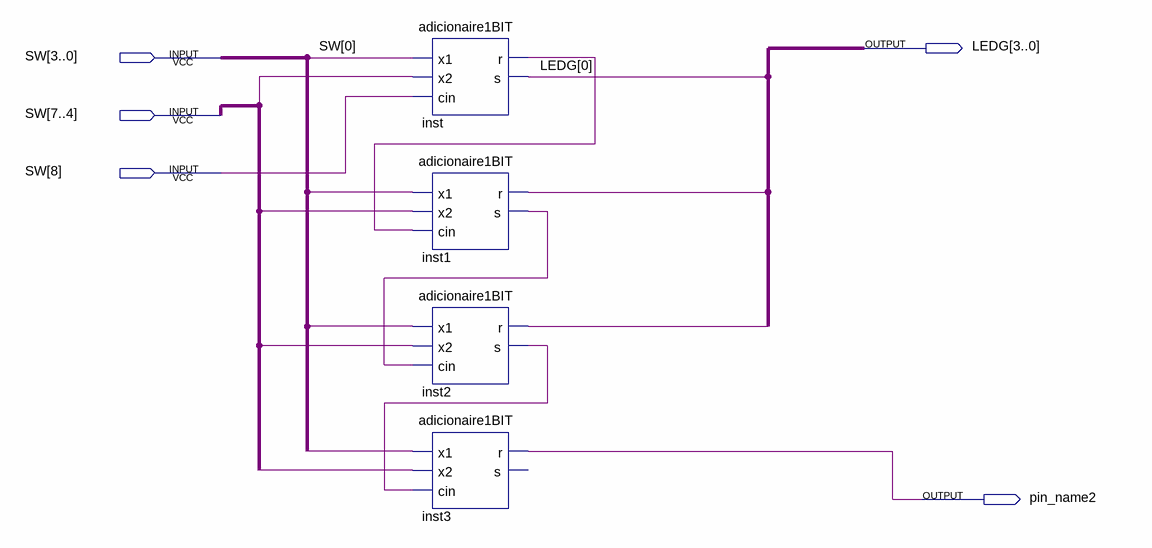
[diagram p0: schematic sheet]
// Quartus schematic adicionaire1.bdf as structural Verilog: 4 symbols, 5 pins
module adicionaire1 (
  input  [8:0] SW,
  output [3:0] LEDG,
  output pin_name2
);

  wire inst1_r, inst1_s, inst2_r, inst2_s, inst_r, undriven, undriven_2, undriven_3, undriven_4, undriven_5,
       undriven_6, undriven_7;

  adicionaire1BIT inst (.x1(SW[0]), .x2(undriven), .cin(SW[8]), .r(inst_r), .s(LEDG[0]));
  adicionaire1BIT inst1 (.x1(undriven_2), .x2(undriven_5), .cin(inst_r), .r(inst1_r), .s(inst1_s));
  adicionaire1BIT inst2 (.x1(undriven_3), .x2(undriven_6), .cin(inst1_s), .r(inst2_r), .s(inst2_s));
  adicionaire1BIT inst3 (.x1(undriven_4), .x2(undriven_7), .cin(inst2_s), .r(pin_name2));  // open: s
endmodule
